# Altium schematic sheet STB_Sensors.SchDoc: STB Validation Board - Sensor
size A4; Author: mayerph; DrawnBy: mayerph; Organization: PBL; Revision: A; SheetNumber: 2; SheetTotal: 4
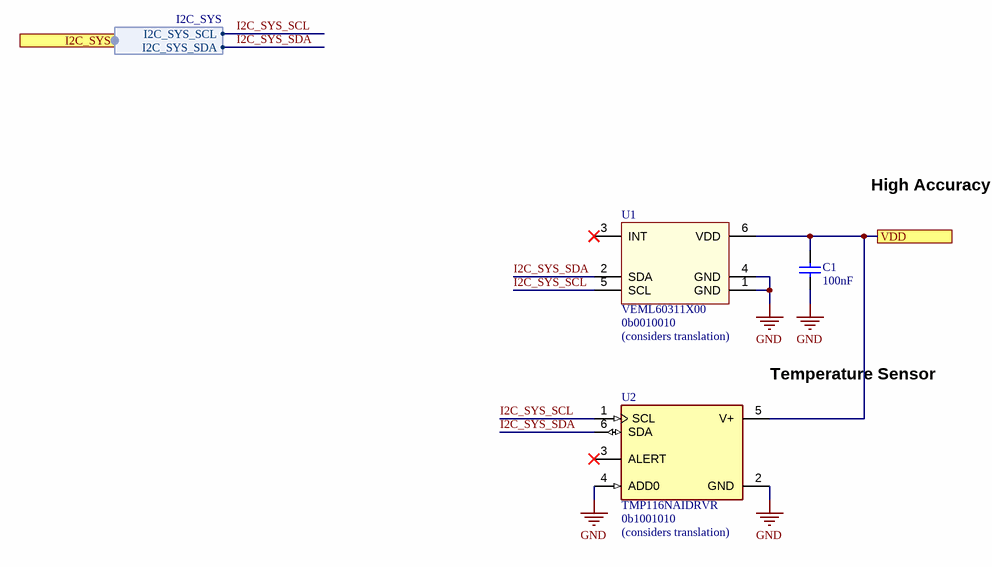
[diagram p0: STB_Sensors.SchDoc]

## Parts
C1  100nF  [CAPC1050X55X23LL05T13]
U1  VEML60311X00  [6-SMD - No Thermal Pad_2]
U2  TMP116NAIDRVR  Address: 0b1001010  [FP-DRV0006B-MFG]

## Ports
I2C_SYS (harness I2C_SYS, see STB_ValidationBoard[6B], STB_Spectrometer[1B], STB_UID[1A]), VDD (see STB_ValidationBoard[6B])

## Harnesses
I2C_SYS: I2C_SYS_SDA, I2C_SYS_SCL

## Nets
GND: C1.1 U1.1(GND) U1.4(GND) U2.2(GND) U2.4(ADD0)
I2C_SYS_SCL: U1.5(SCL) U2.1(SCL) ; port I2C_SYS.I2C_SYS_SCL
I2C_SYS_SDA: U1.2(SDA) U2.6(SDA) ; port I2C_SYS.I2C_SYS_SDA
VDD: C1.2 U1.6(VDD) U2.5(V+) ; port VDD

Not connected (* = marked no-connect by the designer): U1 3(INT)*; U2 3(ALERT)*

## Notes on the sheet
- (near U1) High Accuracy Ambient Light Sensor with IR
- (near U1) 0b0010010
- (near U1) (considers translation)
- (near U2) Temperature Sensor
- (near U2) (considers translation)
- 1
- 2
- 3
- 4
- A
- B
- C
- Project:
- D
- Date:
- Drawing number:
- Rev:
- Format:
- A4 Q
- Drawn by:
- Laboratory:
- Page
- Sheet:
- of
- File:

## Library data of the parts
C1 = CMP-2000-05439-1: Chip Capacitor, 100 nF, +/- 10%, 16 V, -55 to 125 degC, 0402 (1005 Metric), RoHS, Tape and Reel; Manufacturer: Samsung Electro-Mechanics; Manufacturer Part Number: CL05B104KO5NNNC; Dielectric: X7R; Rated Voltage: 16V; Dielectric Material: Ceramic; Multilayer: Yes; Case Size/Dimension: 0402; Tolerance (%): ±10%; Value: 100nF; Manufacturer URL: http://www.samsungsem.com/global/index.jsp; Datasheet URL: https://datasheet.ciiva.com/29198/458718-da-01-en-vs-kondensator-0402-29198423.pdf; Datasheet Version: Nov-10; Supplier 1: Digi-Key; Supplier Part Number 1: 1276-1001-6-ND; RoHS: Yes; Category: Ceramic Capacitors; Stock 1: 24854634; Pricing 1: 1=0.10000, 10=0.02400, 50=0.01300, 100=0.01050, 500=0.00752, 1000=0.00592, 2500=0.00538, 5000=0.00495 (USD); Mount: Surface Mount; Number of Pins: 2; Package Shape: Rectangular; Size Code: 0402; Terminal Finish: Nickel; Min Operating Temperature: -55°C; Max Operating Temperature: 125°C; JESD-609 Code: e3; Capacitor Type: Ceramic; Negative Tolerance: 10%; Packaging: Tape and Reel; Positive Tolerance: 10%; Rated DC Voltage (URdc): 16V; Temperature Characteristics Code: X7R; Termination: Wraparound; Package Style: SMTMeter; Length: 1mm; Width: 0.5mm; Height: 0.55mm; REACH SVHC: Yes; RoHS Compliant: Yes; ComponentLink1URL: https://datasheet.ciiva.com:443/pdfs/VipMasterIC/IC/SEMS/SEMS-S-A0008384515/SEMS-S-A0008872921-1.pdf?src-supplier=IHS+Markit; ComponentLink1Description: https://datasheet.ciiva.com:443/pdfs/VipMasterIC/IC/SEMS/SEMS-S-A0008384515/SEMS-S-A0008872921-1.pdf?src-supplier=IHS+Markit; ComponentLink2URL: https://datasheet.ciiva.com/26920/getdatasheetpartid-359683-26920169.pdf?src-supplier=Verical; ComponentLink2Description: https://datasheet.ciiva.com/26920/getdatasheetpartid-359683-26920169.pdf?src-supplier=Verical; ComponentLink3URL: https://datasheet.ciiva.com/29198/458718-da-01-en-vs-kondensator-0402-29198423.pdf?src-supplier=Conrad; ComponentLink3Description: https://datasheet.ciiva.com/29198/458718-da-01-en-vs-kondensator-0402-29198423.pdf?src-supplier=Conrad; ComponentLink4URL: https://datasheet.ciiva.com/26309/mlcc-catalogdownload2013-eng-26309003.pdf?src-supplier=Distrelec; ComponentLink4Description: https://datasheet.ciiva.com/26309/mlcc-catalogdownload2013-eng-26309003.pdf?src-supplier=Distrelec; ComponentLink5URL: https://datasheet.ciiva.com/16208/cl05b104kq5nnnc-16208343.pdf?src-supplier=Future+Electronics; ComponentLink5Description: https://datasheet.ciiva.com/16208/cl05b104kq5nnnc-16208343.pdf?src-supplier=Future+Electronics
U1 = CMP-02054-1: Ambient Light Sensor, I²C 6-SMD, No Lead; Mfr: Vishay Semiconductor Opto Division; Manufacturer: Vishay; Proximity Detection: Yes; Voltage - Supply: 2.5V ~ 3.6V; Series: -; Type: Ambient; Wavelength: -; Output Type: I²C; Operating Temperature: -40°C ~ 110°C (TA); Mounting Type: Surface Mount; Package / Case: 6-SMD, No Lead; Supplier Device Package: 6-SMD; Supplier 1: Farnell; Supplier Part Number 1: 3765835; Manufacturer Part Number: VEML60311X00; RoHS: No; Category: Uncategorized; Stock 1: 2982; Pricing 1: 1=3.35000, 10=2.44000, 25=2.28000, 50=2.16000 (GBP)
U2 = CMP-04948-000013-1: SENSOR DIGITAL -55C-125C 6WSON; Manufacturer: Texas Instruments; Sensor Output: I2C,SMBus; Max Junction Temp: +150°C; Standoff Height: 0mm; Min Supply Voltage: 1.9V; Max Supply Voltage: 5.5V; Resolution: 16bits; Operating Supply Current: 3.5-135uA; Package Shape/Style: Square; Accuracy-Max (Cel): 0.5°C; Number of Bits: 16; Output Interface Type: 2-Wire; Sensors/Transducers Type: TEMPERATURE SENSOR,SWITCH/DIGITAL OUTPUT,SERIAL; Body Breadth: 2inch; Body Height: 0.8mm; Body Length or Diameter: 2mm; Manufacturer Part Number: TMP116NAIDRVR; Temperature Range Low: -55°C; Temperature: -55°C to +125°C; Ipc Land Pattern Name: DFN200X200X80-6; Device Class L1: Sensors; Package: DRV0006B; Interface: I2C,SMBus; Device Class L3: unset; Ambient Temperature Range Low: -55°C; Lead Free: Yes; Height: 0.8mm; Temperature Range High: +125°C; Digikey Description: SENSOR DIGITAL -55C-125C 6WSON; RoHS: TRUE; Mouser Description: ±0.2°C Accurate Digital Temperature Sensor With NV Memory 6-WSON -55 to 125; Ambient Temperature Range High: +150°C; ComponentLink2Description: Datasheet; Category: IC; Device Class L2: Temperature and Humidity Sensors; ComponentLink2URL: https://www.ti.com/lit/ds/symlink/tmp116.pdf; Octopart: https://octopart.com/tmp116naidrvr-texas+instruments-82367758; Automotive: No; Supplier 1: Digi-Key; Supplier Part Number 1: 296-48306-6-ND; Stock 1: 6627; Pricing 1: 1=2.48000, 10=2.22500, 25=2.09880, 100=1.78820, 250=1.67904, 500=1.46916, 1000=1.26720 (USD); Mount: Surface Mount; Housing Material: Plastic; Terminal Finish: Nickel; Min Operating Temperature: -55°C; Max Operating Temperature: 150°C; JESD-609 Code: e4; Termination: Solder; REACH SVHC: Yes; RoHS Compliant: Yes; ComponentLink1URL: https://www.ti.com:443/lit/ds/symlink/tmp116.pdf?src-supplier=IHS+Markit; ComponentLink1Description: https://www.ti.com:443/lit/ds/symlink/tmp116.pdf?src-supplier=IHS+Markit; ComponentLink3URL: http://www.ti.com/lit/ds/symlink/tmp116.pdf?src-supplier=Digi-Key; ComponentLink3Description: http://www.ti.com/lit/ds/symlink/tmp116.pdf?src-supplier=Digi-Key